# EAGLE design Link232-wifi (EAGLE 9.6.2)
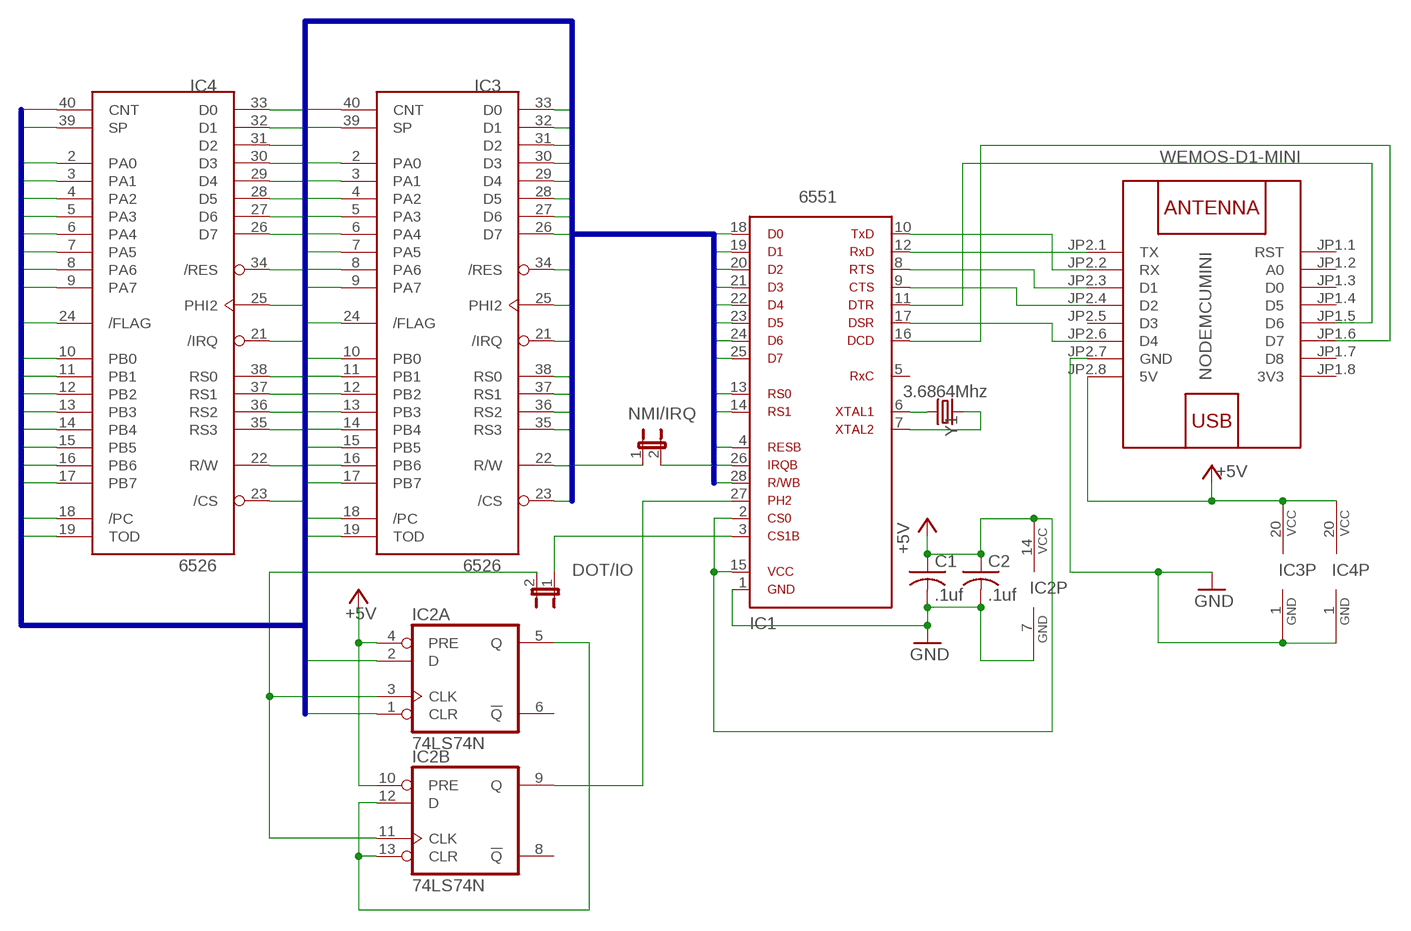
[diagram p0: schematic, sheet 1]

## Parts
C1  .1uf  C-US050-024X044  [C050-024X044]
C2  .1uf  C-US050-024X044  [C050-024X044]
IC1  6551  [6551]
IC2  74LS74N  [DIL14]
IC3  6526  [DIP40]
IC4  6526  [DIP40]
JP1  NMI/IRQ  JP1E  [JP1]
JP2  DOT/IO  JP1E  [JP1]
NODEMCUMINI  WEMOS-D1-MINI  [WEMOS-D1-MINI]
Y1  3.6864Mhz  CRYSTALPTH-HC49US  [HC49US]

## Nets
+5V: C1.1 C2.1 IC1.2 IC1.15 IC2.4(A:PRE) IC2.10(B:PRE) IC2.14(P:VCC) IC3.20(VCC) IC4.20(VCC) NODEMCUMINI.JP2.8(5V)
/CS: IC3.23(/CS) IC4.23(/CS)
/FLAG: IC3.24(/FLAG) IC4.24(/FLAG)
/PC: IC3.18(/PC) IC4.18(/PC)
CNT: IC3.40(CNT) IC4.40(CNT)
D0: IC1.18 IC3.33(D0) IC4.33(D0)
D1: IC1.19 IC3.32(D1) IC4.32(D1)
D2: IC1.20 IC3.31(D2) IC4.31(D2)
D3: IC1.21 IC3.30(D3) IC4.30(D3)
D4: IC1.22 IC3.29(D4) IC4.29(D4)
D5: IC1.23 IC3.28(D5) IC4.28(D5)
D6: IC1.24 IC3.27(D6) IC4.27(D6)
D7: IC1.25 IC3.26(D7) IC4.26(D7)
GND: C1.2 C2.2 IC1.1 IC2.7(P:GND) IC3.1(GND) IC4.1(GND) NODEMCUMINI.JP2.7(GND)
IRQ: IC3.21(/IRQ) IC4.21(/IRQ) JP1.1
N$1: IC2.3(A:CLK) IC2.11(B:CLK) JP2.2
N$2: IC2.5(A:Q) IC2.12(B:D) IC2.13(B:CLR)
N$3: IC1.27 IC2.9(B:Q)
N$4: IC1.26 JP1.2
N$5: IC1.3 JP2.1
N$9: IC1.6 Y1.2
N$10: IC1.7 Y1.1
N$11: IC1.12 NODEMCUMINI.JP2.1(TX)
N$12: IC1.10 NODEMCUMINI.JP2.2(RX)
N$13: IC1.8 NODEMCUMINI.JP2.3(D1)
N$14: IC1.9 NODEMCUMINI.JP2.4(D2)
N$15: IC1.17 NODEMCUMINI.JP2.6(D4)
N$16: IC1.11 NODEMCUMINI.JP1.5(D6)
N$17: IC1.16 NODEMCUMINI.JP1.6(D7)
PA0: IC3.2(PA0) IC4.2(PA0)
PA1: IC3.3(PA1) IC4.3(PA1)
PA2: IC3.4(PA2) IC4.4(PA2)
PA3: IC3.5(PA3) IC4.5(PA3)
PA4: IC3.6(PA4) IC4.6(PA4)
PA5: IC3.7(PA5) IC4.7(PA5)
PA6: IC3.8(PA6) IC4.8(PA6)
PA7: IC3.9(PA7) IC4.9(PA7)
PB0: IC3.10(PB0) IC4.10(PB0)
PB1: IC3.11(PB1) IC4.11(PB1)
PB2: IC3.12(PB2) IC4.12(PB2)
PB3: IC3.13(PB3) IC4.13(PB3)
PB4: IC3.14(PB4) IC4.14(PB4)
PB5: IC3.15(PB5) IC4.15(PB5)
PB6: IC3.16(PB6) IC4.16(PB6)
PB7: IC3.17(PB7) IC4.17(PB7)
PHI2: IC2.1(A:CLR) IC2.2(A:D) IC3.25(PHI2) IC4.25(PHI2)
RES: IC1.4 IC3.34(/RES) IC4.34(/RES)
RS0: IC1.13 IC3.38(RS0) IC4.38(RS0)
RS1: IC1.14 IC3.37(RS1) IC4.37(RS1)
RS2: IC3.36(RS2) IC4.36(RS2)
RS3: IC3.35(RS3) IC4.35(RS3)
RW: IC1.28 IC3.22(R/W) IC4.22(R/W)
SP: IC3.39(SP) IC4.39(SP)
TOD: IC3.19(TOD) IC4.19(TOD)
Unconnected: IC1.5 IC2.6(A:!Q) IC2.8(B:!Q) NODEMCUMINI.JP1.1(RST) NODEMCUMINI.JP1.2(A0) NODEMCUMINI.JP1.3(D0) NODEMCUMINI.JP1.4(D5) NODEMCUMINI.JP1.7(D8) NODEMCUMINI.JP2.5(D3)

## Buses
CNT,/CS,D0,D1,D2,D3,D4,D5,D6,D7,/FLAG,IRQ,PA0,PA1,PA2,PA3,PA4,PA5,PA6,PA7,PB0,PB1,PB2,PB3,PB4,PB5,PB6,PB7,/PC,PHI2,RES,RS0,RS1,RS2,RS3,RW,SP,TOD

## Power pins joined to a net without a drawn wire
3V3: NODEMCUMINI.JP1.8(3V3)

## Library data of the parts
C1 C2 = rcl:C-US: CAPACITOR, American symbol; SPICEPREFIX: C
IC1 = 65xx:6551: Dual In Line
IC2 = 74xx-us:74*74: Dual D type positive edge triggered FLIP FLOP, preset and clear
IC3 IC4 = 0RB_65xx:6526: I/O device: two 8-bits ports, handshake lines, timers. Used in C64 and C128.
JP1 JP2 = jumper:JP1E: JUMPER
NODEMCUMINI = diy-modules:WEMOS-D1-MINI: WEMOS D1 mini: Mini Wi-Fi Board based on ESP-8266 device More details can be found here: https://www.wemos.cc/product/d1-mini.html Click here to find device on ebay.com <http://www.ebay.com/sch/wemos+d1+mini+nodemcu>
Y1 = SparkFun-Clocks:CRYSTAL: Crystals (Generic) These are passive quartz crystals, which can be used as a clock source for a microcontroller. Crystal's are two-terminal devices. They require external "load" capacitors to generate an oscillating signal.

## Board
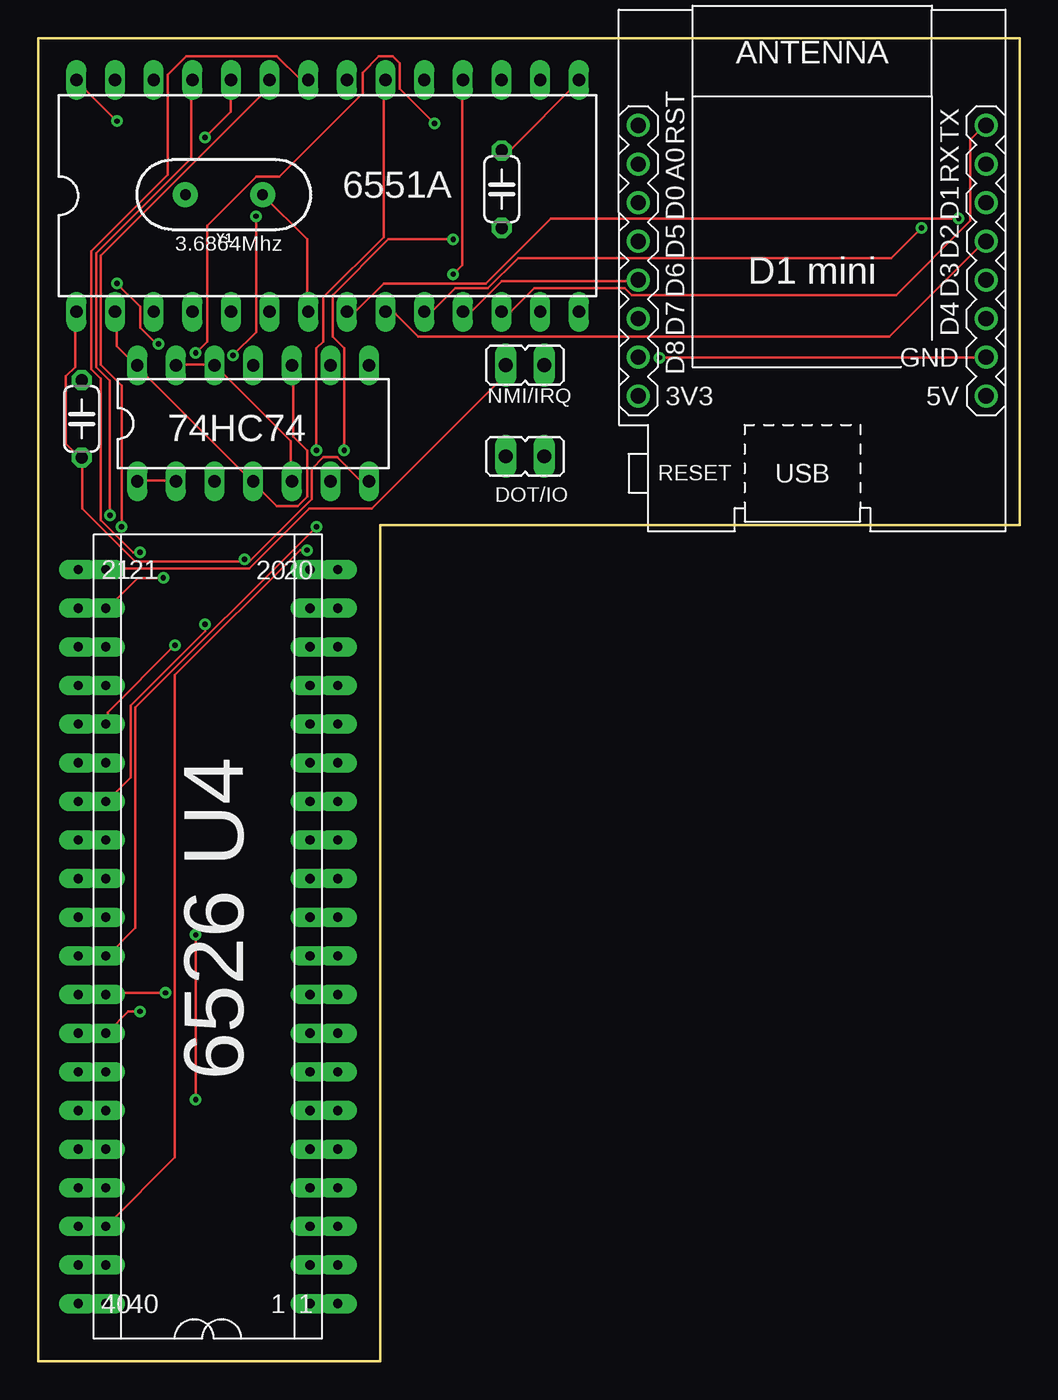
[diagram p1: board, top side]
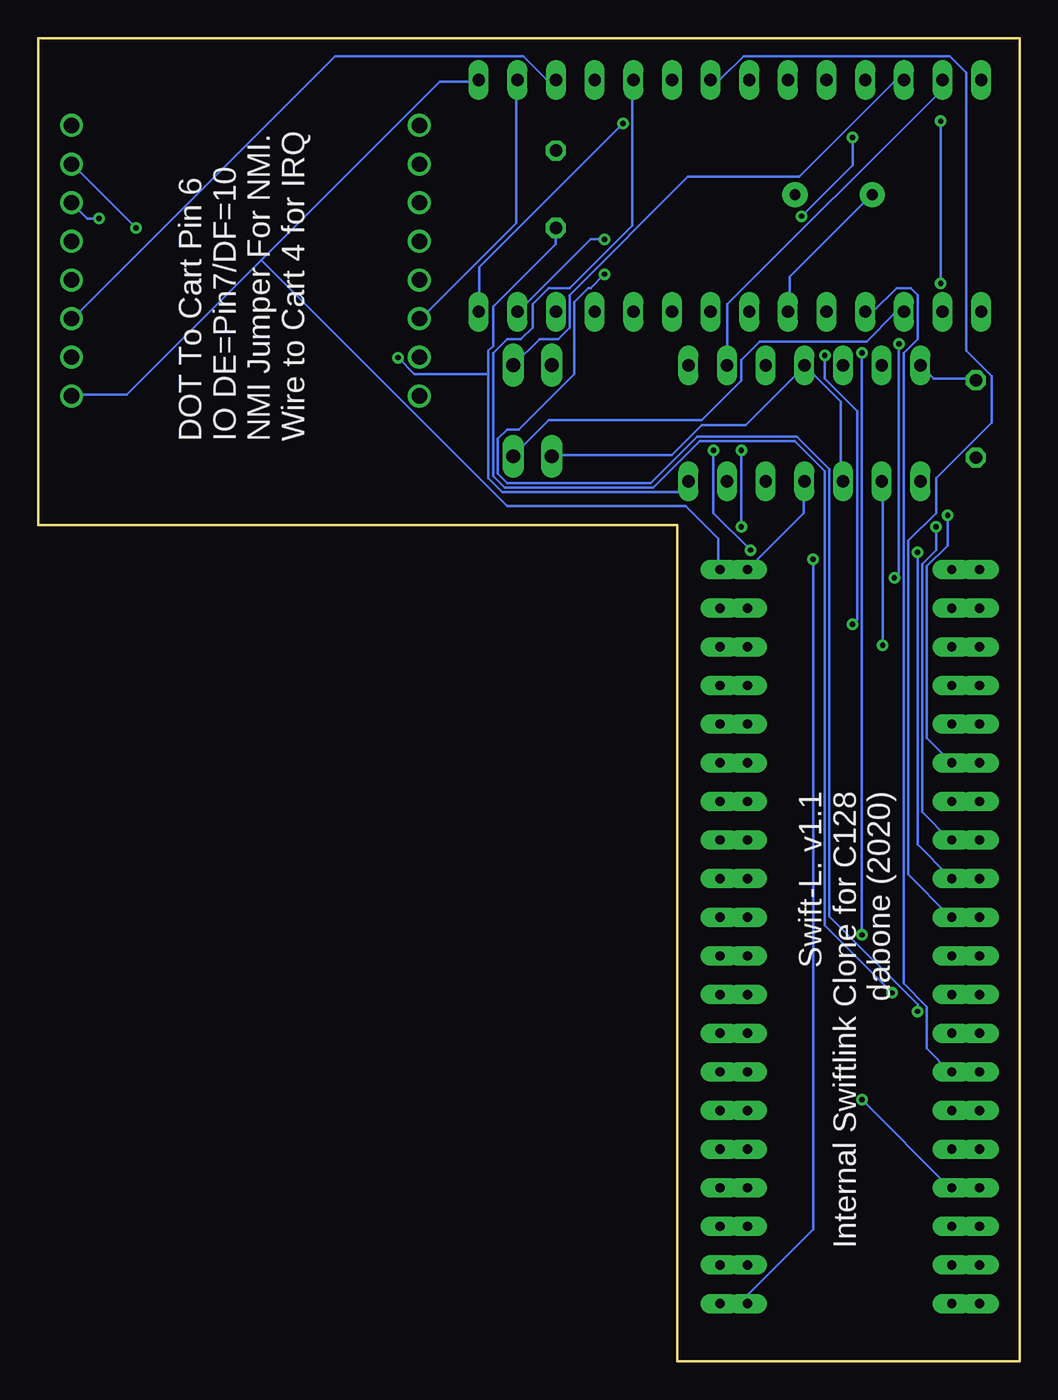
[diagram p2: board, bottom side, seen from below]

Size 64.5 x 87 mm. Coordinates in mm from the lower left corner, seen from the top.
Outline: 0,0 22.5,0 22.5,55 64.5,55 64.5,87 0,87 0,0
Copper layers (1*16): Top 0.035mm / dielectric 1.5mm / Bottom 0.035mm
Design rules "default": minimum track width 6mil, minimum drill 0.35mm, track to track 6mil, track to pad 6mil, pad to pad 6mil, via to via 6mil, smd to smd 6mil, copper to edge 40mil, drill to drill 6mil, minimum pad ring 10mil, minimum via ring 8mil, stop-mask expansion 4mil, vias tented up to drill 0mil, thermal gap 10mil

### Footprints (pad centres in the part's own frame; a part is rotated, then mirrored left to right if it is on the bottom)
C050-024X044 = drill 0.813 octagon: 1 -2.54,0; 2 2.54,0
6551 = drill 0.813 long: 1 -16.51,-7.62; 2 -13.97,-7.62; 3 -11.43,-7.62; 4 -8.89,-7.62; 5 -6.35,-7.62; 6 -3.81,-7.62; 7 -1.27,-7.62; 8 1.27,-7.62; 9 3.81,-7.62; 10 6.35,-7.62; 11 8.89,-7.62; 12 11.43,-7.62; 13 13.97,-7.62; 14 16.51,-7.62; 15 16.51,7.62; 16 13.97,7.62; 17 11.43,7.62; 18 8.89,7.62; 19 6.35,7.62; 20 3.81,7.62; 21 1.27,7.62; 22 -1.27,7.62; 23 -3.81,7.62; 24 -6.35,7.62; 25 -8.89,7.62; 26 -11.43,7.62; 27 -13.97,7.62; 28 -16.51,7.62
DIL14 = drill 0.813 long: 1 -7.62,-3.81; 2 -5.08,-3.81; 3 -2.54,-3.81; 4 0,-3.81; 5 2.54,-3.81; 6 5.08,-3.81; 7 7.62,-3.81; 8 7.62,3.81; 9 5.08,3.81; 10 2.54,3.81; 11 0,3.81; 12 -2.54,3.81; 13 -5.08,3.81; 14 -7.62,3.81
DIP40 = drill 0.61 pad 1.27 long: 1 -24.13,-7.62; 2 -21.59,-7.62; 3 -19.05,-7.62; 4 -16.51,-7.62; 5 -13.97,-7.62; 6 -11.43,-7.62; 7 -8.89,-7.62; 8 -6.35,-7.62; 9 -3.81,-7.62; 10 -1.27,-7.62; 11 1.27,-7.62; 12 3.81,-7.62; 13 6.35,-7.62; 14 8.89,-7.62; 15 11.43,-7.62; 16 13.97,-7.62; 17 16.51,-7.62; 18 19.05,-7.62; 19 21.59,-7.62; 20 24.13,-7.62; 21 24.13,7.62; 22 21.59,7.62; 23 19.05,7.62; 24 16.51,7.62; 25 13.97,7.62; 26 11.43,7.62; 27 8.89,7.62; 28 6.35,7.62; 29 3.81,7.62; 30 1.27,7.62; 31 -1.27,7.62; 32 -3.81,7.62; 33 -6.35,7.62; 34 -8.89,7.62; 35 -11.43,7.62; 36 -13.97,7.62; 37 -16.51,7.62; 38 -19.05,7.62; 39 -21.59,7.62; 40 -24.13,7.62
JP1 = drill 0.914 long: 1 0,-1.27; 2 0,1.27
WEMOS-D1-MINI = drill 1: JP1.1 -11.43,9.525; JP1.2 -11.43,6.985; JP1.3 -11.43,4.445; JP1.4 -11.43,1.905; JP1.5 -11.43,-0.635; JP1.6 -11.43,-3.175; JP1.7 -11.43,-5.715; JP1.8 -11.43,-8.255; JP2.1 11.43,9.525; JP2.2 11.43,6.985; JP2.3 11.43,4.445; JP2.4 11.43,1.905; JP2.5 11.43,-0.635; JP2.6 11.43,-3.175; JP2.7 11.43,-5.715; JP2.8 11.43,-8.255
HC49US = drill 0.7 pad 1.651: 1 -2.54,0; 2 2.54,0

### Placement (x,y rotation side)
C1  30.47,77.06 270 top
C2  2.87,61.96 270 top
IC1  19.03,76.63 0 top
IC2  14.14,61.66 0 top
IC3  10.26,27.93 90 top
IC4  12.07,27.93 90 top
JP1  32,65.5 270 top
JP2  32,59.5 90 top
NODEMCUMINI  50.87,71.73 0 top
Y1  12.22,76.7 180 top

### Tracks (layer width: path | path; a pad name or v marks a point on that pad's centre or on a via)
+5V
  Top 0.152: IC1.2 5.18,68.89 5.18,66.75 6.4,65.53 IC2.14 6.55,65.38 14.02,57.91 IC2.4 14.17,57.76 15.7,56.24 17.07,56.24 17.68,56.84 17.68,59.89 16.76,60.81 16.76,65.38 IC2.10 | IC3.20 17.98,52.12 19.66,52.12 IC4.20 | C1.1 30.48,79.7 31.09,79.7 35.51,84.12 IC1.15
  Bottom 0.152: C2.1 2.9,64.62 5.64,64.62 6.4,65.38 IC2.14 | IC2.4 14.17,57.76 14.17,55.78 17.83,52.12 IC3.20 | 49.84,72.39 38.1,84.12 35.66,84.12 IC1.15 | 49.84,72.39 58.67,63.55 62.18,63.55 NODEMCUMINI.JP2.8 | 49.84,72.39 33.68,56.24 21.95,56.24 19.81,54.1 19.81,52.12 IC4.20
/CS
  Top 0.152: IC3.23 2.74,46.94 4.42,46.94 IC4.23
/FLAG
  Top 0.152: IC3.24 2.74,44.5 4.42,44.5 IC4.24
/PC
  Top 0.152: IC3.18 17.98,46.94 19.66,46.94 IC4.18
CNT
  Top 0.152: IC3.40 2.74,3.81 4.42,3.81 IC4.40
D0  (via drill 0.35)
  Top 0.152: IC3.33 2.74,21.64 4.42,21.64 IC4.33 4.57,21.64 5.94,23.01 v6.71,23.01 | v27.28,71.48 27.89,72.08 27.89,84.12 IC1.18
  Bottom 0.152: v27.28,71.48 28.19,70.56 28.35,70.56 29.26,69.65 29.26,64.92 32.92,61.27 33.68,61.27 34.29,60.66 34.29,58.37 33.68,57.76 24.23,57.76 21.18,60.81 14.63,60.81 12.5,58.67 12.5,29.26 6.71,23.47 v6.71,23.01
D1  (via drill 0.35)
  Top 0.152: IC3.32 2.74,24.08 4.42,24.08 IC4.32 4.57,24.23 v8.38,24.23
  Bottom 0.152: v8.38,24.23 12.8,28.65 12.8,58.52 14.78,60.5 21.03,60.5 24.08,57.45 33.83,57.45 34.59,58.22 34.59,66.29 33.68,67.21 32.77,67.21 32,67.97 32,69.49 30.94,70.56 29.57,70.56 25.45,74.68 25.45,84.12 IC1.19
D2  (via drill 0.35)
  Top 0.152: IC3.31 2.74,26.67 4.42,26.67 IC4.31 4.57,26.67 6.4,28.5 6.4,42.98 v18.29,54.86 | v18.29,59.89 18.29,66.6 18.75,67.06 18.75,69.95 22.71,73.91 22.71,84.12 IC1.20
  Bottom 0.152: v18.29,54.86 v18.29,59.89
D3
  Top 0.152: IC3.30 2.74,29.26 4.42,29.26 IC4.30
  Bottom 0.152: IC1.21 20.27,84.28 19.66,84.28 18.14,85.8 4.57,85.8 3.5,84.73 3.5,66.45 1.83,64.77 1.83,61.72 5.49,58.06 5.49,55.78 7.32,53.95 7.32,32 4.57,29.26 IC4.30
D4  (via drill 0.35)
  Top 0.152: IC3.29 2.74,31.7 4.42,31.7 IC4.29 | v6.71,53.19 6.25,53.19 4.12,55.32 4.12,64.62 3.5,65.23 3.5,73 8.53,78.03 8.53,84.58 9.75,85.8 15.7,85.8 17.22,84.28 17.68,84.28 IC1.22
  Bottom 0.152: v6.71,53.19 6.71,33.98 4.57,31.85 IC4.29
D5  (via drill 0.35)
  Top 0.152: IC3.28 2.74,34.29 4.42,34.29 IC4.28 | v5.49,54.86 5.49,64.16 4.12,65.53 4.12,72.69 15.09,83.67 15.09,84.12 IC1.23
  Bottom 0.152: v5.49,54.86 5.49,53.34 6.4,52.43 6.4,36.12 4.57,34.29 IC4.28
D6  (via drill 0.35)
  Top 0.152: IC3.27 2.74,36.88 4.42,36.88 IC4.27 4.57,36.88 6.1,38.41 6.1,43.13 10.97,48.01 v10.97,48.46 | v10.97,80.47 12.65,82.14 12.65,84.12 IC1.24 | v14.33,75.29 14.33,67.67 v12.8,66.14
  Bottom 0.152: v10.97,80.47 10.97,78.64 v14.33,75.29 | v12.8,66.14 12.8,64.62 10.67,62.48 10.67,48.77 v10.97,48.46
D7  (via drill 0.35)
  Top 0.152: IC3.26 2.74,39.32 4.42,39.32 IC4.26 | v4.72,55.63 4.72,64.47 3.81,65.38 3.81,72.85 10.06,79.1 10.06,84.12 IC1.25
  Bottom 0.152: v4.72,55.63 4.72,53.65 6.1,52.27 6.1,41 4.57,39.47 IC4.26
GND  (via drill 0.35)
  Top 0.152: IC3.1 17.98,3.81 19.66,3.81 IC4.1 | 13.56,52.58 6.4,52.58 2.9,56.08 2.9,59.28 C2.2 2.74,59.44 1.83,60.35 1.83,64.77 2.44,65.38 2.44,68.89 IC1.1 | 13.56,52.58 13.87,52.58 17.98,56.69 17.98,58.67 18.75,59.44 19.66,59.44 21.18,57.91 21.64,57.91 IC2.7 | v40.84,65.99 62.18,65.99 NODEMCUMINI.JP2.7 | 13.56,52.58 v13.56,52.73
  Bottom 0.152: 34.9,64.92 34.9,58.06 33.98,57.15 22.4,57.15 21.79,57.76 IC2.7 | 34.9,64.92 34.9,66.45 34.59,66.75 34.59,69.34 30.48,73.46 30.48,74.37 C1.2 | v40.84,65.99 39.78,64.92 34.9,64.92 | v13.56,52.73 13.56,8.69 17.83,4.42 17.83,3.81 IC3.1
IRQ
  Top 0.152: IC3.21 2.74,52.12 4.42,52.12 IC4.21 4.57,52.12 13.87,52.12 17.83,56.08 21.95,56.08 30.63,64.77 30.63,65.38 JP1.1
N$1
  Bottom 0.152: IC2.3 11.73,57.91 11.73,63.09 14.02,65.38 IC2.11 14.17,65.38 17.98,61.57 20.88,61.57 22.86,59.59 30.63,59.59 JP2.2
N$2
  Top 0.152: IC2.5 16.61,57.91 16.61,60.5 11.73,65.38 IC2.12 11.58,65.53 9.14,65.53 IC2.13
N$3
  Bottom 0.152: IC1.27 5.18,84.12 5.18,83.52 19.2,69.49 19.2,65.53 IC2.9
N$4
  Bottom 0.152: IC1.26 7.62,84.12 8.23,84.12 14.48,77.88 21.79,77.88 29.57,70.1 29.57,67.97 30.33,67.21 31.55,67.21 33.22,65.53 JP1.2
N$5
  Bottom 0.152: IC1.3 7.62,68.89 8.23,68.89 10.06,67.06 17.07,67.06 18.29,65.84 18.29,64.47 20.88,61.87 30.94,61.87 33.22,59.59 JP2.1
N$9
  Bottom 0.152: IC1.6 15.09,69.04 15.09,71.32 9.75,76.66 Y1.2
N$10
  Top 0.152: IC1.7 17.68,69.04 17.68,73.76 14.78,76.66 Y1.1
N$11
  Top 0.152: IC1.12 30.48,69.04 31.09,69.04 32.61,70.56 38.56,70.56 39.01,70.1 56.39,70.1 61.27,74.98 61.27,80.31 62.18,81.23 NODEMCUMINI.JP2.1
N$12  (via drill 0.35)
  Top 0.152: v58.06,74.52 56.08,72.54 31.55,72.54 29.57,70.56 27.43,70.56 25.91,69.04 25.45,69.04 IC1.10
  Bottom 0.152: v58.06,74.52 62.18,78.64 NODEMCUMINI.JP2.2
N$13  (via drill 0.35)
  Top 0.152: v60.5,75.13 33.68,75.13 29.41,70.87 22.71,70.87 20.88,69.04 20.42,69.04 IC1.8
  Bottom 0.152: v60.5,75.13 61.27,75.13 62.18,76.05 NODEMCUMINI.JP2.3
N$14
  Top 0.152: IC1.9 22.86,68.89 23.47,68.89 24.99,67.36 55.93,67.36 62.18,73.61 NODEMCUMINI.JP2.4
N$15
  Bottom 0.152: IC1.17 30.48,84.28 31.09,84.28 32.61,85.8 44.96,85.8 62.18,68.58 NODEMCUMINI.JP2.6
N$16
  Top 0.152: IC1.11 28.04,69.04 28.5,69.04 30.48,71.02 39.32,71.02 NODEMCUMINI.JP1.5
N$17
  Bottom 0.152: IC1.16 33.07,84.12 33.07,74.83 39.32,68.58 NODEMCUMINI.JP1.6
PA0
  Top 0.152: IC3.2 17.98,6.4 19.66,6.4 IC4.2
PA1
  Top 0.152: IC3.3 17.98,8.84 19.66,8.84 IC4.3
PA2
  Top 0.152: IC3.4 17.98,11.43 19.66,11.43 IC4.4
PA3
  Top 0.152: IC3.5 17.98,14.02 19.66,14.02 IC4.5
PA4
  Top 0.152: IC3.6 17.98,16.46 19.66,16.46 IC4.6
PA5
  Top 0.152: IC3.7 17.98,19.05 19.66,19.05 IC4.7
PA6
  Top 0.152: IC3.8 17.98,21.64 19.66,21.64 IC4.8
PA7
  Top 0.152: IC3.9 17.98,24.08 19.66,24.08 IC4.9
PB0
  Top 0.152: IC3.10 17.98,26.67 19.66,26.67 IC4.10
PB1
  Top 0.152: IC3.11 17.98,29.26 19.66,29.26 IC4.11
PB2
  Top 0.152: IC3.12 17.98,31.7 19.66,31.7 IC4.12
PB3
  Top 0.152: IC3.13 17.98,34.29 19.66,34.29 IC4.13
PB4
  Top 0.152: IC3.14 17.98,36.88 19.66,36.88 IC4.14
PB5
  Top 0.152: IC3.15 17.98,39.32 19.66,39.32 IC4.15
PB6
  Top 0.152: IC3.16 17.98,41.91 19.66,41.91 IC4.16
PB7
  Top 0.152: IC3.17 17.98,44.5 19.66,44.5 IC4.17
PHI2  (via drill 0.35)
  Top 0.152: IC3.25 2.74,41.91 4.42,41.91 IC4.25 4.57,41.91 4.57,42.67 v8.99,47.09 | IC2.1 6.55,57.91 8.99,57.91 IC2.2
  Bottom 0.152: v8.99,47.09 8.99,57.76 IC2.2
RES
  Top 0.152: IC3.34 2.74,19.05 4.42,19.05 IC4.34
  Bottom 0.152: IC1.4 10.06,69.04 9.6,69.04 8.08,70.56 7.16,70.56 6.71,70.1 6.71,67.21 7.62,66.29 7.62,24.84 6.1,23.32 6.1,20.57 4.57,19.05 IC4.34
RS0  (via drill 0.35)
  Top 0.152: IC3.38 2.74,8.84 4.42,8.84 IC4.38 4.57,8.99 8.99,13.41 8.99,45.11 17.22,53.34 v17.68,53.34 | v27.28,73.76 23.01,73.76 19.36,70.1 19.36,67.36 20.12,66.6 v20.12,59.89
  Bottom 0.152: v27.28,73.76 28.19,73.76 32.92,69.04 IC1.13 | v20.12,59.89 20.12,55.78 v17.68,53.34
RS1  (via drill 0.35)
  Top 0.152: IC3.37 2.74,11.43 4.42,11.43 IC4.37 | v26.06,81.38 23.77,83.67 23.77,85.34 23.32,85.8 22.4,85.8 21.34,84.73 21.34,83.36 15.85,77.88 14.33,77.88 11.12,74.68 11.12,67.06 v10.36,66.29 | v10.36,17.22 v10.36,28.04
  Bottom 0.152: v26.06,81.38 35.51,71.93 35.51,69.04 IC1.14 | v10.36,28.04 v10.36,66.29 | v10.36,17.22 4.57,11.43 IC4.37
RS2
  Top 0.152: IC3.36 2.74,14.02 4.42,14.02 IC4.36
RS3
  Top 0.152: IC3.35 2.74,16.46 4.42,16.46 IC4.35
RW  (via drill 0.35)
  Top 0.152: IC3.22 2.74,49.53 4.42,49.53 IC4.22 4.57,49.53 6.55,51.51 v8.23,51.51 | v5.18,81.53 2.59,84.12 IC1.28 | v5.18,70.87 6.71,69.34 6.71,67.97 7.77,66.9 v7.92,66.9
  Bottom 0.152: v5.18,70.87 v5.18,81.53 | v7.92,66.9 7.92,51.82 v8.23,51.51
SP
  Top 0.152: IC3.39 2.74,6.4 4.42,6.4 IC4.39
TOD
  Top 0.152: IC3.19 17.98,49.53 19.66,49.53 IC4.19

### Text on the board
tPlace: 6551A | 3.6864Mhz | NMI/IRQ | 74HC74 | DOT/IO | 6526 U4
bPlace: DOT To Cart Pin 6 / IO DE=Pin7/DF=10 / NMI Jumper For NMI. / Wire to Cart 4 for IRQ | Swift-L. v1.1 / Internal Swiftlink Clone for C128 / dabone (2020)